# EAGLE design mcp73831_breakout (EAGLE 7.4.0)
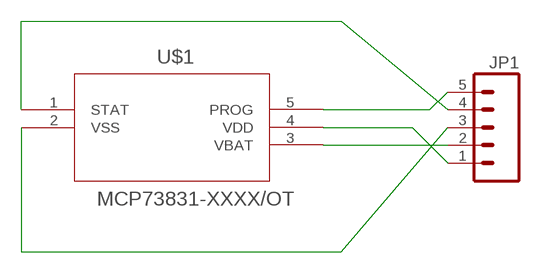
[diagram p0: schematic, sheet 1]

## Parts
JP1  M05PTH  [1X05]
U$1  MCP73831-XXXX/OT  [SOT-23-5_MC]

## Nets
N$1: JP1.5 U$1.5(PROG)
N$2: JP1.1 U$1.4(VDD)
N$3: JP1.2 U$1.3(VBAT)
N$4: JP1.3 U$1.2(VSS)
N$5: JP1.4 U$1.1(STAT)

## Library data of the parts
JP1 = SparkFun-Connectors:M05: Header 5 Standard 5-pin 0.1" header. Use with straight break away headers (SKU : PRT-00116), right angle break away headers (PRT-00553), swiss pins (PRT-00743), machine pins (PRT-00117), and female headers (PRT-00115). Molex polarized connector foot print use with SKU : PRT-08230 with associated crimp pins and housings.
U$1 = MCP73831:MCP73831-XXXX/OT

## Board
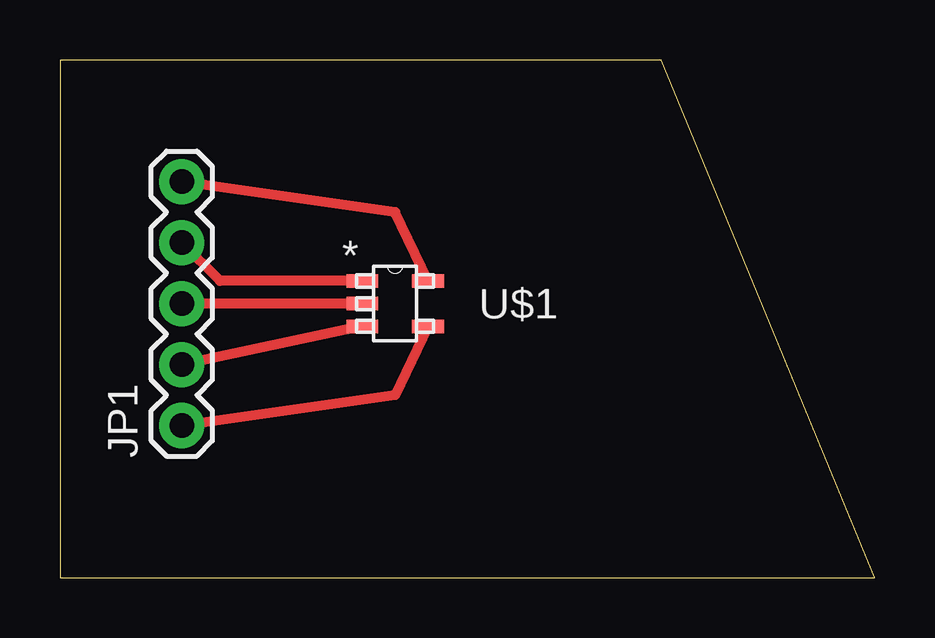
[diagram p1: board, top side]

Size 33.96 x 21.58 mm. Coordinates in mm from the lower left corner, seen from the top.
Outline: 0,0 33.96,0 25.07,21.58 0,21.58 0,0
Copper layers (1*16): Top 0.0356mm / dielectric 1.5011mm / Bottom 0.0356mm
Design rules "LaenPCBOrder": minimum track width 6mil, minimum drill 13mil, track to track 6mil, track to pad 6mil, pad to pad 6mil, via to via 6mil, smd to smd 6mil, copper to edge 15mil, drill to drill 6mil, minimum pad ring 7mil, minimum via ring 7mil, stop-mask expansion 3mil, vias tented up to drill 0mil, thermal gap 10mil

### Footprints (pad centres in the part's own frame; a part is rotated, then mirrored left to right if it is on the bottom)
1X05 = drill 1.016 pad 1.88: 1 0,0; 2 2.54,0; 3 5.08,0; 4 7.62,0; 5 10.16,0
SOT-23-5_MC = smd 1.321 x 0.559: 1 -1.371,0.95; 2 -1.371,0; 3 -1.371,-0.95; 4 1.371,-0.95; 5 1.371,0.95

### Placement (x,y rotation side)
JP1  5.08,6.35 90 top
U$1  13.97,11.43 0 top

### Tracks (layer width: path | path; a pad name or v marks a point on that pad's centre or on a via)
N$1
  Top 0.406: U$1.5 13.97,15.24 JP1.5
N$2
  Top 0.406: U$1.4 13.97,7.62 JP1.1
N$3
  Top 0.406: U$1.3 JP1.2
N$4
  Top 0.406: U$1.2 JP1.3
N$5
  Top 0.406: U$1.1 6.67,12.38 JP1.4